# Altium schematic sheet ProjectInfo.SchDoc
size A4; Organization: Medical Technologies CZ a.s.; DocumentNumber: ?; SheetNumber: 2; SheetTotal: 10; Version1: N/A; Version2: N/A; Version3: N/A; Change1description: N/A; Change2description: N/A; Change3description: N/A; Change1DrawnBy: N/A; Change2DrawnBy: N/A; Change3DrawnBy: N/A; Change1CheckedBy: N/A; Change2CheckedBy: N/A; Change3CheckedBy: N/A; PreviusVersion_Chng1: N/A; PreviusVersion_Chng2: N/A; PreviusVersion_Chng3: N/A; Variant1description: Standard assembly; Variant2description: N/A; Variant3description: N/A; Variant4description: N/A; PrimaryCard1: XXXxxxXXX; PrimaryCard2: N/A; PrimaryCard3: N/A; PrimaryCard4: N/A; DocumentName: Docname
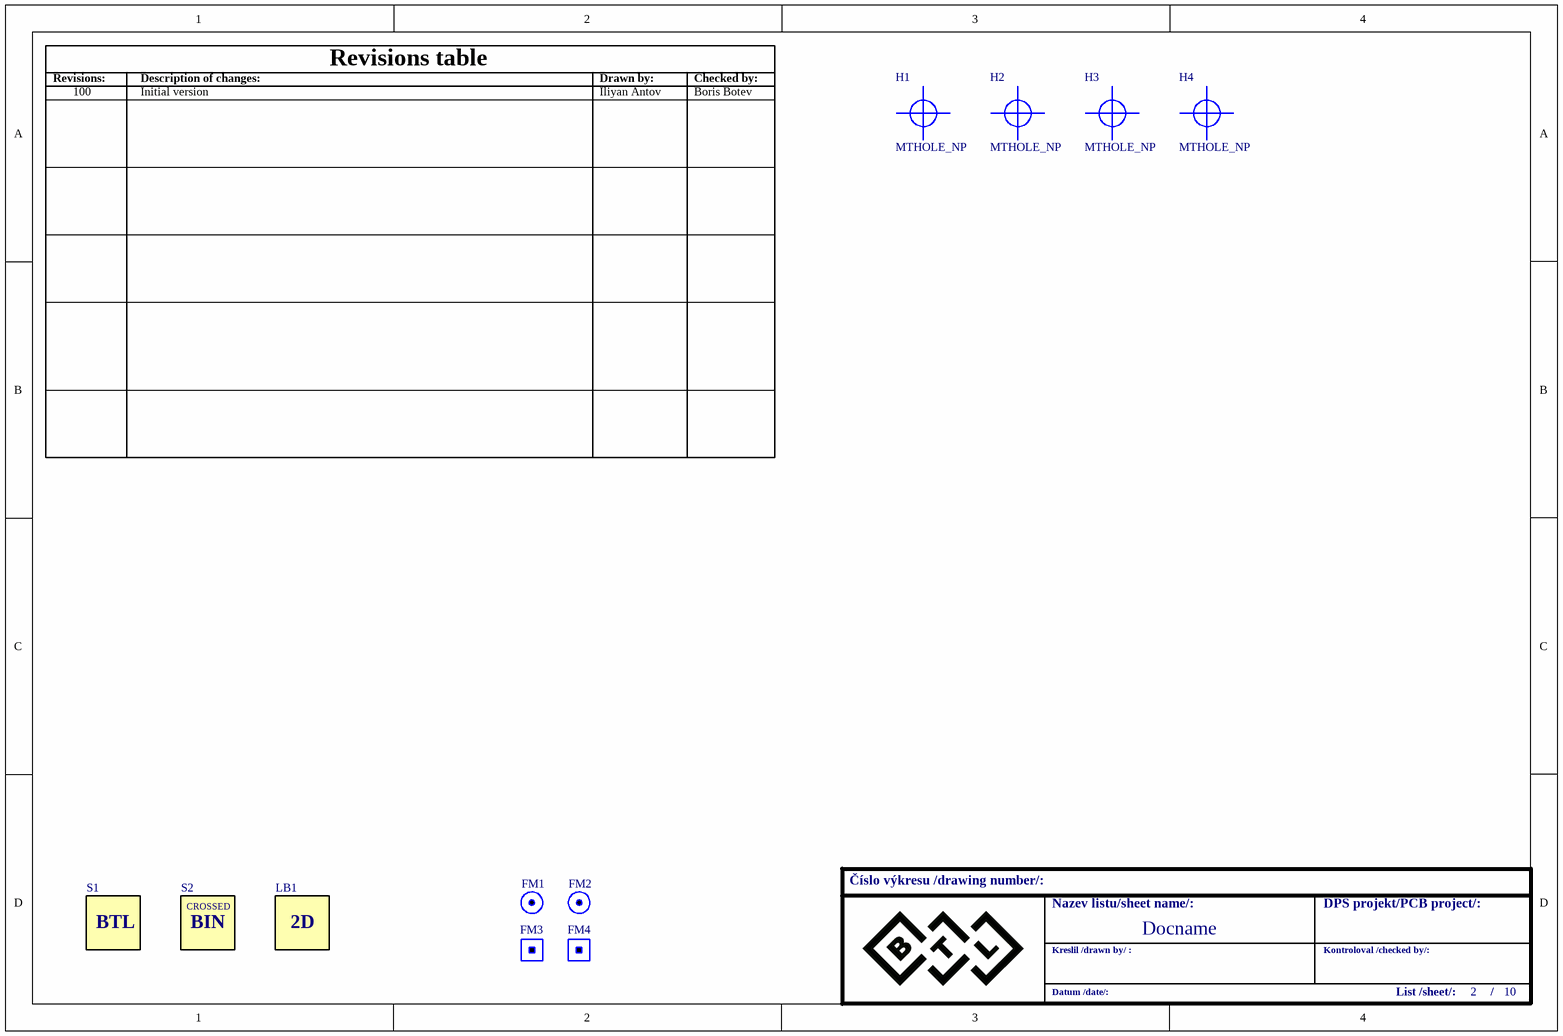
[diagram p0: ProjectInfo.SchDoc]

## Parts
FM1  Fiducial Mark Circle  [FM_CIRCLE_BTL]  (value not drawn)
FM2  Fiducial Mark Circle  [FM_CIRCLE_BTL]  (value not drawn)
FM3  Fiducial Mark Square  [FM_SQUARE_BTL]  (value not drawn)
FM4  Fiducial Mark Square  [FM_SQUARE_BTL]  (value not drawn)
H1  MTHOLE_NP  [HOLE3.5MM_NONPLATED]  (no BOM)
H2  MTHOLE_NP  [HOLE3.5MM_NONPLATED]  (no BOM)
H3  MTHOLE_NP  [HOLE3.5MM_NONPLATED]  (no BOM)
H4  MTHOLE_NP  [HOLE3.5MM_NONPLATED]  (no BOM)
LB1  LABEL_MATRIX_CODE  [MATRIX_CODE]  (value not drawn)  (no BOM)
S1  SYMBOL_LOGO_BTL  [BTL_LOGO_3MM]  (value not drawn)  (no BOM)
S2  SYMBOL_CROSSED_BIN  [CROSSED_BIN]  (value not drawn)  (no BOM)

## Nets

Not connected (* = marked no-connect by the designer): H1 #; H2 #; H3 #; H4 #

## Notes on the sheet
- Revisions:
- 100
- Description of changes:
- Initial version
- Revisions table
- Drawn by:
- Iliyan Antov
- Checked by:
- Boris Botev
- Číslo výkresu /drawing number/:
- Nazev listu/sheet name/:
- DPS projekt/PCB project/:
- Kreslil /drawn by/ :
- Kontroloval /checked by/:
- Datum /date/:
- List /sheet/:
- /
- (in symbol 000-SPACE2D100) 2D
- (in symbol 000-SYMBIN100) CROSSED; BIN
- (in symbol 000-SYMBTL100) BTL

## Library data of the parts
FM1 FM2 = 000+FMC100: De; Fiducial Mark;; Component_Class: Design Entity; Status_I: Development; Status_II: Testing; KK: 000+FMC100; Value: Fiducial Mark Circle; SMD: 1; Entity_Type: Fiducial Mark; ComponentLink1URL: heliosgreen://v1/hegMT/5-MT/Classes(343)/Folders/OpenForm?RecordNumbers=[12022158]; ComponentLink1Description: Helios
FM3 FM4 = 000+FMS100: De; Fiducial Mark;; Component_Class: Design Entity; Status_I: Development; Status_II: Testing; KK: 000+FMS100; Value: Fiducial Mark Square; SMD: 1; Entity_Type: Fiducial Mark; ComponentLink1URL: heliosgreen://v1/hegMT/5-MT/Classes(343)/Folders/OpenForm?RecordNumbers=[12022164]; ComponentLink1Description: Helios
H1-H4 = 000-HOLE3.5NP100: De; Hole;; Note: Hole 3,5mm, Nonplated; Component_Class: Design Entity; Status_I: Development; Status_II: Approval pending; KK: 000-HOLE3.5NP100; Value: MTHOLE_NP; SMD: 0; Entity_Type: Hole; ComponentLink1URL: heliosgreen://v1/hegMT/5-MT/Classes(343)/Folders/OpenForm?RecordNumbers=[13035934]; ComponentLink1Description: Helios
LB1 = 000-SPACE2D100: De; Space for...;; Note: Space for 2D code sticker; Component_Class: Design Entity; Status_I: Development; Status_II: Testing; KK: 000-SPACE2D100; Value: LABEL_MATRIX_CODE; SMD: 0; Entity_Type: Space for...; ComponentLink1URL: heliosgreen://v1/hegMT/5-MT/Classes(343)/Folders/OpenForm?RecordNumbers=[12022194]; ComponentLink1Description: Helios
S1 = 000-SYMBTL100: De; Symbols/Tables;; Note: Symbol BTL logos for silkscreen or Copper; Component_Class: Design Entity; Status_I: Development; Status_II: Testing; KK: 000-SYMBTL100; Value: SYMBOL_LOGO_BTL; SMD: 0; Entity_Type: Symbols/Tables; ComponentLink1URL: heliosgreen://v1/hegMT/5-MT/Classes(343)/Folders/OpenForm?RecordNumbers=[12022368]; ComponentLink1Description: Helios
S2 = 000-SYMBIN100: De; Symbols/Tables;; Note: Symbol Crossed Bin; Component_Class: Design Entity; Status_I: Development; Status_II: Testing; KK: 000-SYMBIN100; Value: SYMBOL_CROSSED_BIN; SMD: 0; Entity_Type: Symbols/Tables; ComponentLink1URL: heliosgreen://v1/hegMT/5-MT/Classes(343)/Folders/OpenForm?RecordNumbers=[12022356]; ComponentLink1Description: Helios